# EAGLE design EKG_Modul_Versorgung (EAGLE 9.3.1)
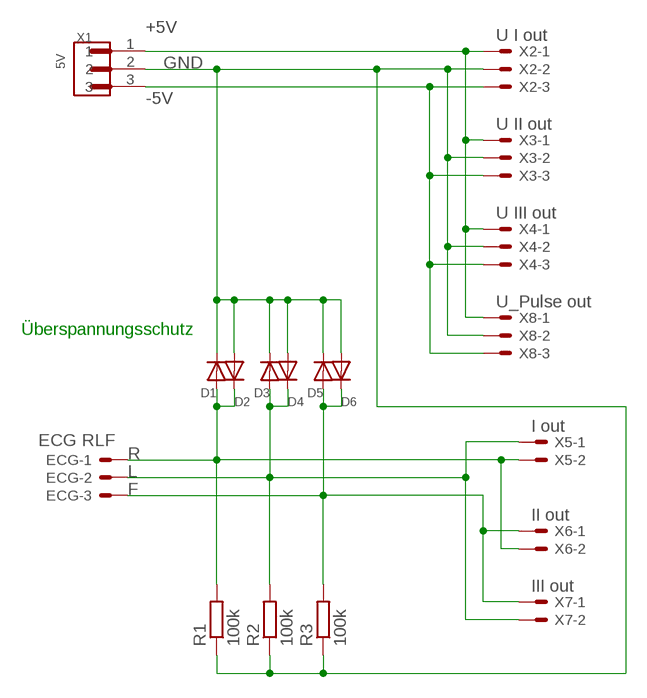
[diagram p0: schematic, sheet 1]

## Parts
D1  DIODEDO-1N4148  [DO-1N4148]
D2  DIODEDO-1N4148  [DO-1N4148]
D3  DIODEDO-1N4148  [DO-1N4148]
D4  DIODEDO-1N4148  [DO-1N4148]
D5  DIODEDO-1N4148  [DO-1N4148]
D6  DIODEDO-1N4148  [DO-1N4148]
ECG  ECG RLF  JST-XH-03-PIN-LONG-PAD  [JST-XH-03-PACKAGE-LONG-PAD]
R1  100k  R-EU_0207/7  [0207/7]
R2  100k  R-EU_0207/7  [0207/7]
R3  100k  R-EU_0207/7  [0207/7]
X1  5V  B3P-VH(LF)(SN)  [JST_B3P-VH(LF)(SN)]
X2  U I out  JST-XH-03-PIN-LONG-PAD  [JST-XH-03-PACKAGE-LONG-PAD]
X3  U II out  JST-XH-03-PIN-LONG-PAD  [JST-XH-03-PACKAGE-LONG-PAD]
X4  U III out  JST-XH-03-PIN-LONG-PAD  [JST-XH-03-PACKAGE-LONG-PAD]
X5  I out  JST-XH-02-PIN-LONG-PAD  [JST-XH-02-PACKAGE-LONG-PAD]
X6  II out  JST-XH-02-PIN-LONG-PAD  [JST-XH-02-PACKAGE-LONG-PAD]
X7  III out  JST-XH-02-PIN-LONG-PAD  [JST-XH-02-PACKAGE-LONG-PAD]
X8  U_Pulse out  JST-XH-03-PIN-LONG-PAD  [JST-XH-03-PACKAGE-LONG-PAD]

## Nets
+5V: X1.1 X2.1 X3.1 X4.1 X8.1
-5V: X1.3 X2.3 X3.3 X4.3 X8.3
F: D5.A D6.C ECG.3 R3.2 X6.1 X7.1
GND: D1.C D2.A D3.C D4.A D5.C D6.A R1.1 R2.1 R3.1 X1.2 X2.2 X3.2 X4.2 X8.2
L: D3.A D4.C ECG.2 R2.2 X5.1 X7.2
R: D1.A D2.C ECG.1 R1.2 X5.2 X6.2

## Notes on the sheet
- Überspannungsschutz

## Library data of the parts
D1-D6 = adafruit:DIODE: Diode SMADIODE - SMA Surface Mount Package 20V 1A Schottky Diode Digikey: 641-1014-6-ND DO-1N4148 - Through Hole Small Current Diode SOD-123 20V 1 A (.5mV Vf) Schottky Diode - Digikey: MBRX120TPMSCT-ND SOD-323 10V 570mA (.38mV Vf, 3ns) Schottky Diode - Digikey: ZLLS410CT-ND SOD-523 30V 30mA Schottky Diode (RB751S-40TE61) - Digikey: RB751S-40TE61CT-ND SOT23-R/W - SOT23 Package (R = Solder Paste/Reflow Ovens, W = Hand-Soldering) BAT54Film 40V 300mA - Digikey: 497-7162-1-ND
ECG X2-X4 X8 = Rembrandt Electronics - JST XH Connectors v1-0:JST-XH-03-PIN: JST XH Connector 2 Pin Wire to board connector. Pitch: 2,54 mm, (0.100") Number of pins: 3 Created by Rembrandt Electronics www.rembrandtelectronics.com
R1-R3 = rcl:R-EU_: RESISTOR, European symbol; SPICEPREFIX: R
X1 = B3P-VH_LF__SN_:B3P-VH(LF)(SN): VH Series 3 Position 3.96 mm Pitch Through Hole Crimp Locking Header; AVAILABILITY: Good; DESCRIPTION: VH Series 3 Position 3.96 mm Pitch Through Hole Crimp Locking Header; MF: JST; MP: B3P-VH_LF__SN_; PACKAGE: FakePackage u; PRICE: 0.12 USD
X5-X7 = Rembrandt Electronics - JST XH Connectors v1-0:JST-XH-02-PIN: JST XH Connector 2 Pin Wire to board connector. Pitch: 2,54 mm, (0.100") Number of pins: 2 Created by Rembrandt Electronics www.rembrandtelectronics.com

## Board
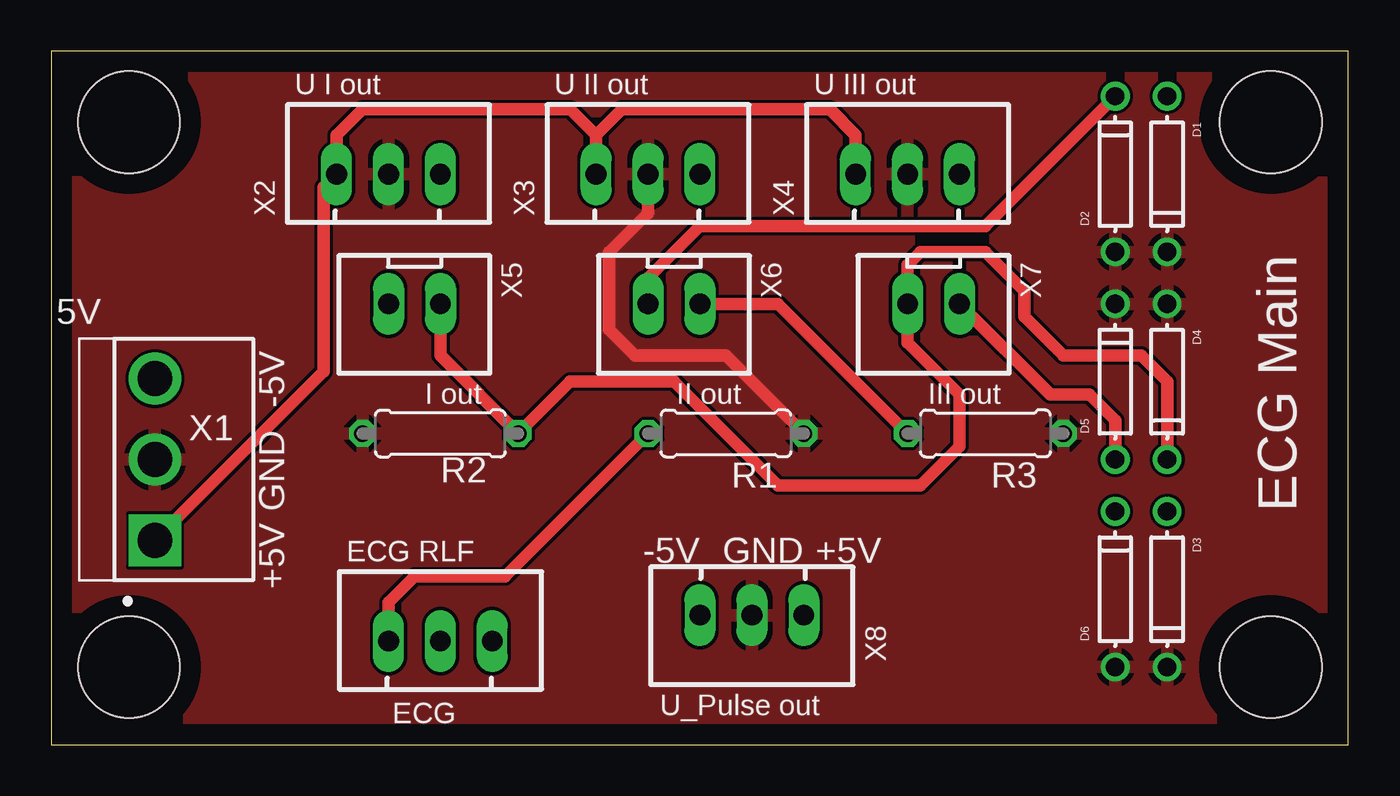
[diagram p1: board, top side]
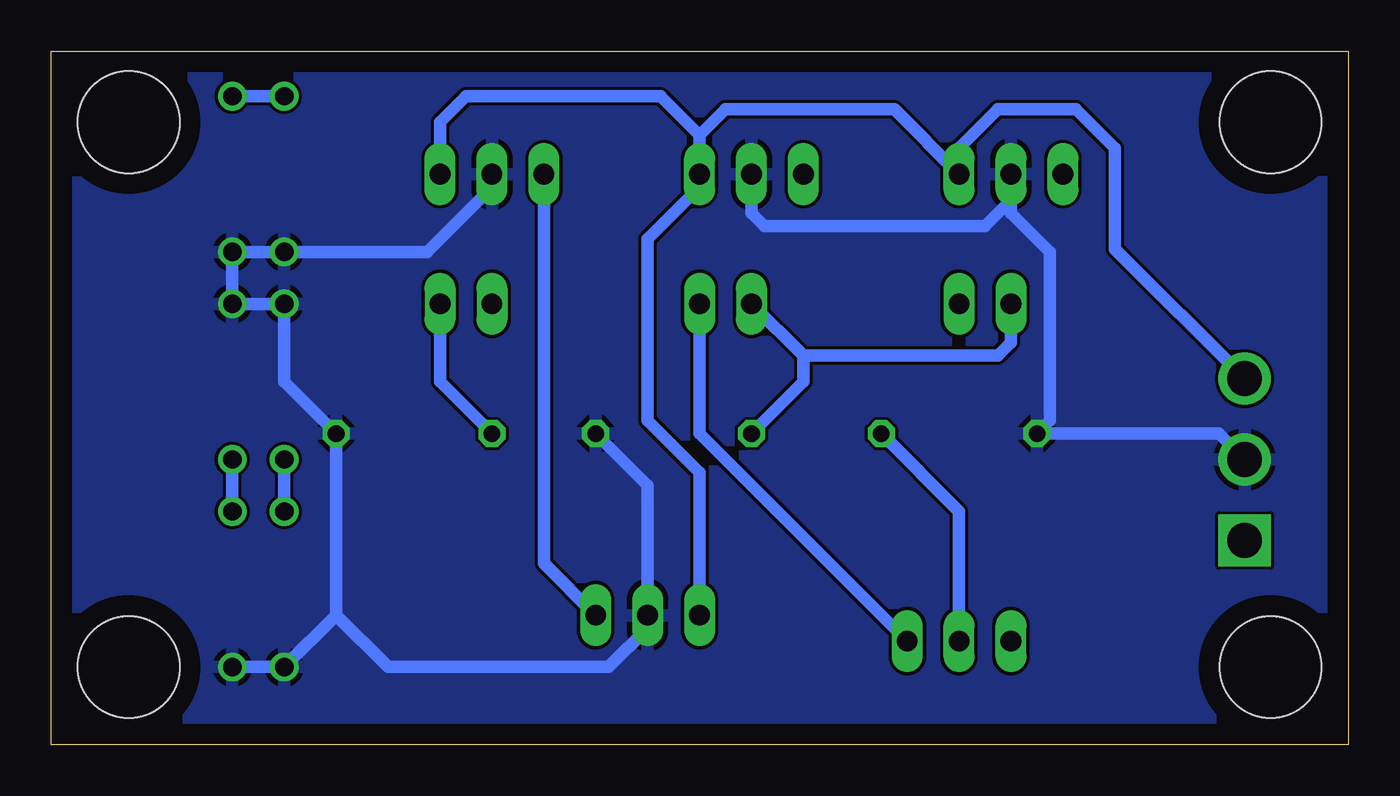
[diagram p2: board, bottom side, seen from below]

Size 63.48 x 33.96 mm. Coordinates in mm from the lower left corner, seen from the top.
Outline: 0,0 63.48,0 63.48,33.96 0,33.96 0,0
Copper layers (1*16): Top 0.035mm / dielectric 1.5mm / Bottom 0.035mm
Design rules "default": minimum track width 6mil, minimum drill 0.35mm, track to track 6mil, track to pad 6mil, pad to pad 6mil, via to via 6mil, smd to smd 6mil, copper to edge 40mil, drill to drill 6mil, minimum pad ring 10mil, minimum via ring 8mil, stop-mask expansion 4mil, vias tented up to drill 0mil, thermal gap 10mil
Holes 4.98 mm at 3.81,30.48 3.81,3.81 59.69,30.48 59.69,3.81

### Footprints (pad centres in the part's own frame; a part is rotated, then mirrored left to right if it is on the bottom)
DO-1N4148 = drill 0.9: A -3.81,0; C 3.81,0
JST-XH-03-PACKAGE-LONG-PAD = drill 1.016 long: 1 -2.54,0; 2 0,0; 3 2.54,0
0207/7 = drill 0.813 octagon: 1 -3.81,0; 2 3.81,0
JST_B3P-VH(LF)(SN) = drill 1.7 square: 1 -3.96,0 | drill 1.7: 2 0,0; 3 3.96,0
JST-XH-02-PACKAGE-LONG-PAD = drill 1.016 long: 1 -1.27,0; 2 1.27,0

### Placement (x,y rotation side)
D1  54.61,27.94 270 top
D2  52.07,27.94 90 top
D3  54.61,7.62 270 top
D4  54.61,17.78 270 top
D5  52.07,17.78 90 top
D6  52.07,7.62 90 top
ECG  19.05,5.08 0 top
R1  33.02,15.24 180 top
R2  19.05,15.24 0 top
R3  45.72,15.24 180 top
X1  5.08,13.97 90 top
X2  16.51,27.94 0 top
X3  29.21,27.94 0 top
X4  41.91,27.94 0 top
X5  17.78,21.59 180 top
X6  30.48,21.59 180 top
X7  43.18,21.59 180 top
X8  34.29,6.35 180 top

### Tracks (layer width: path | path; a pad name or v marks a point on that pad's centre or on a via)
+5V
  Top 0.61: X1.1 13.34,18.27 13.34,27.31 X2.1 13.97,29.84 15.24,31.12 25.4,31.12 26.67,29.84 | X3.1 26.67,29.84 | 26.67,29.84 27.94,31.12 38.1,31.12 39.37,29.84 X4.1
  Bottom 0.61: X4.1 39.37,8.89 X8.1
-5V
  Bottom 0.61: 31.75,29.84 30.48,31.12 22.23,31.12 X2.3 19.05,29.21 17.14,31.12 13.34,31.12 11.43,29.21 11.43,24.28 X1.3 | 31.75,29.84 X3.3 31.75,27.31 34.29,24.77 34.29,15.88 31.75,13.34 X8.3 | X4.3 44.45,30.48 43.18,31.75 33.66,31.75 31.75,29.84
F
  Top 0.61: X6.1 35.56,21.59 R3.2 | D5.A 52.07,15.88 50.8,17.15 48.9,17.15 X7.1
  Bottom 0.61: D6.C D5.A | X6.1 31.75,15.24 ECG.3 | X7.1 44.45,17.78 R3.2
GND
  Top 0.61: R1.1 33.02,19.05 28.57,19.05 27.3,20.32 27.3,24.13 29.21,26.04 X3.2
  Bottom 0.61: D3.C D6.A 49.53,6.35 | 49.53,6.35 R3.1 52.07,17.78 D5.C D4.A D1.C D2.A 45.09,24.13 41.91,27.31 X4.2 | X3.2 29.21,26.04 28.57,25.4 17.78,25.4 16.51,26.67 X2.2 16.51,26.04 14.61,24.13 14.61,15.88 R2.1 6.35,15.24 X1.2 | R1.1 34.29,12.7 X8.2 34.29,5.72 36.2,3.81 46.99,3.81 49.53,6.35
  pour Top: 0,33.66 63.5,33.66 63.5,0 0,0
  pour Bottom: 0,33.66 63.5,33.66 63.5,0 0,0
L
  Top 0.61: D4.C 54.61,17.78 53.34,19.05 49.53,19.05 47.62,20.95 47.62,22.23 45.72,24.13 42.55,24.13 41.91,23.5 X7.2 41.91,19.69 44.45,17.15 44.45,14.61 42.55,12.7 35.56,12.7 30.48,17.78 25.4,17.78 R2.2 19.05,19.05 X5.1
  Bottom 0.61: D3.A D4.C | ECG.2 19.05,11.43 R2.2
R
  Top 0.61: R1.2 22.23,8.26 17.78,8.26 16.51,6.98 ECG.1 | X6.2 29.21,22.86 31.75,25.4 45.72,25.4 D2.C
  Bottom 0.61: D1.A D2.C | 26.67,19.05 17.14,19.05 16.51,19.69 X5.2 | X6.2 26.67,19.05 | R1.2 26.67,17.78 26.67,19.05

### Text on the board
tNames: -5V | GND | ECG Main | -5V | GND | +5V | +5V